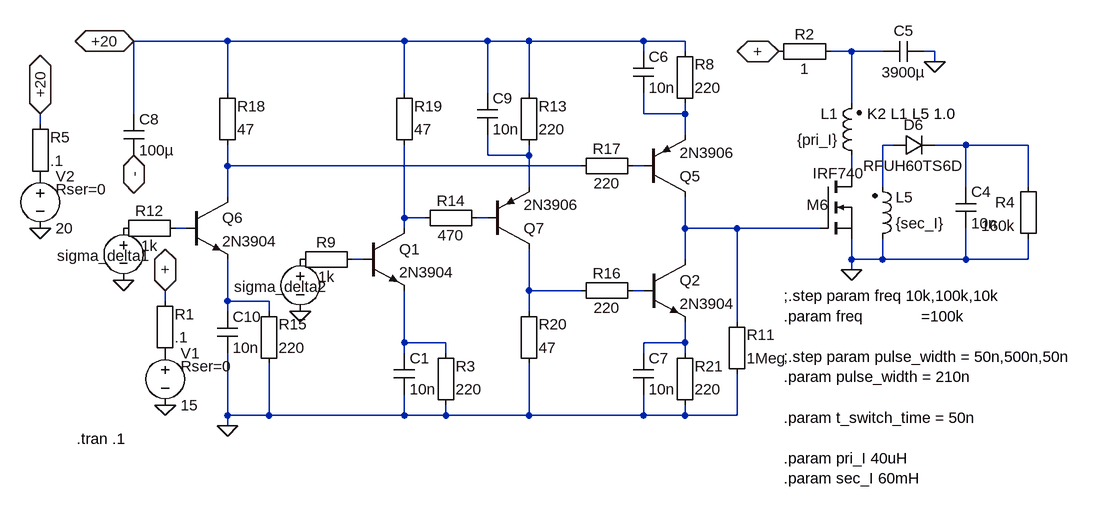
[diagram p0: schematic metal_SMPS_400v_70%_5.asc]
metal_SMPS_400v_70%_5.asc, the LTspice schematic file:
Version 4
SHEET 1 6068 1612
WIRE 2288 -2576 2144 -2576
WIRE 2560 -2576 2288 -2576
WIRE 2688 -2576 2560 -2576
WIRE 2752 -2576 2688 -2576
WIRE 2928 -2576 2752 -2576
WIRE 2992 -2576 2928 -2576
WIRE 2928 -2560 2928 -2576
WIRE 2992 -2560 2992 -2576
WIRE 3248 -2560 3216 -2560
WIRE 3296 -2560 3248 -2560
WIRE 3376 -2560 3360 -2560
WIRE 3376 -2544 3376 -2560
WIRE 2288 -2496 2288 -2576
WIRE 2560 -2496 2560 -2576
WIRE 2688 -2496 2688 -2576
WIRE 2752 -2496 2752 -2576
WIRE 3248 -2480 3248 -2560
WIRE 2144 -2464 2144 -2576
WIRE 2928 -2464 2928 -2496
WIRE 2992 -2464 2992 -2480
WIRE 2992 -2464 2928 -2464
WIRE 2000 -2448 2000 -2464
WIRE 2992 -2432 2992 -2464
WIRE 3312 -2416 3296 -2416
WIRE 3424 -2416 3376 -2416
WIRE 3520 -2416 3424 -2416
WIRE 2688 -2400 2688 -2432
WIRE 2752 -2400 2752 -2416
WIRE 2752 -2400 2688 -2400
WIRE 2288 -2384 2288 -2416
WIRE 2832 -2384 2288 -2384
WIRE 2928 -2384 2912 -2384
WIRE 3248 -2368 3248 -2400
WIRE 2752 -2352 2752 -2400
WIRE 3296 -2352 3296 -2416
WIRE 3424 -2352 3424 -2416
WIRE 3520 -2352 3520 -2416
WIRE 2288 -2336 2288 -2384
WIRE 2560 -2304 2560 -2416
WIRE 2592 -2304 2560 -2304
WIRE 2688 -2304 2672 -2304
WIRE 2224 -2288 2208 -2288
WIRE 2560 -2288 2560 -2304
WIRE 2992 -2288 2992 -2336
WIRE 3072 -2288 2992 -2288
WIRE 3200 -2288 3072 -2288
WIRE 2496 -2240 2480 -2240
WIRE 2992 -2240 2992 -2288
WIRE 3248 -2240 3248 -2272
WIRE 3296 -2240 3296 -2272
WIRE 3296 -2240 3248 -2240
WIRE 3424 -2240 3424 -2288
WIRE 3424 -2240 3296 -2240
WIRE 3520 -2240 3520 -2272
WIRE 3520 -2240 3424 -2240
WIRE 3248 -2224 3248 -2240
WIRE 2752 -2192 2752 -2256
WIRE 2832 -2192 2752 -2192
WIRE 2928 -2192 2912 -2192
WIRE 2192 -2176 2192 -2192
WIRE 2288 -2176 2288 -2240
WIRE 2352 -2176 2288 -2176
WIRE 2288 -2160 2288 -2176
WIRE 2352 -2160 2352 -2176
WIRE 2752 -2160 2752 -2192
WIRE 3072 -2144 3072 -2288
WIRE 2560 -2112 2560 -2192
WIRE 2624 -2112 2560 -2112
WIRE 2992 -2112 2992 -2144
WIRE 2992 -2112 2928 -2112
WIRE 2560 -2096 2560 -2112
WIRE 2624 -2096 2624 -2112
WIRE 2928 -2096 2928 -2112
WIRE 2992 -2096 2992 -2112
WIRE 2288 -2000 2288 -2096
WIRE 2352 -2000 2352 -2080
WIRE 2352 -2000 2288 -2000
WIRE 2560 -2000 2560 -2032
WIRE 2560 -2000 2352 -2000
WIRE 2624 -2000 2624 -2016
WIRE 2624 -2000 2560 -2000
WIRE 2752 -2000 2752 -2080
WIRE 2752 -2000 2624 -2000
WIRE 2928 -2000 2928 -2032
WIRE 2928 -2000 2752 -2000
WIRE 2992 -2000 2992 -2016
WIRE 2992 -2000 2928 -2000
WIRE 3072 -2000 3072 -2064
WIRE 3072 -2000 2992 -2000
WIRE 2288 -1984 2288 -2000
FLAG 3248 -2224 0
FLAG 3376 -2544 0
FLAG 3136 -2560 +
IOPIN 3136 -2560 BiDir
FLAG 2144 -2400 -
IOPIN 2144 -2400 BiDir
FLAG 2400 -2160 0
FLAG 2128 -2208 0
FLAG 2144 -2576 +20
IOPIN 2144 -2576 BiDir
FLAG 2288 -1984 0
FLAG 2192 -2192 +
IOPIN 2192 -2192 BiDir
FLAG 2192 -2016 0
FLAG 2000 -2464 +20
IOPIN 2000 -2464 BiDir
FLAG 2000 -2288 0
SYMBOL ind2 3280 -2256 M180
WINDOW 0 36 80 Left 2
WINDOW 3 36 40 Left 2
SYMATTR InstName L5
SYMATTR Value {sec_I}
SYMATTR SpiceLine Rser=.42
SYMATTR Type ind
SYMBOL diode 3312 -2400 R270
WINDOW 0 32 32 VTop 2
WINDOW 3 0 32 VBottom 2
SYMATTR InstName D6
SYMATTR Value RFUH60TS6D
SYMBOL Misc\\EuropeanCap 3408 -2352 R0
SYMATTR InstName C4
SYMATTR Value 10n
SYMBOL Misc\\EuropeanResistor 3536 -2368 M0
SYMATTR InstName R4
SYMATTR Value 160k
SYMBOL nmos 3200 -2368 R0
WINDOW 0 -21 44 Left 2
WINDOW 3 -12 -5 Left 2
SYMATTR InstName M6
SYMATTR Value IRF740
SYMBOL ind2 3264 -2384 R180
WINDOW 0 36 80 Left 2
WINDOW 3 36 40 Left 2
SYMATTR InstName L1
SYMATTR Value {pri_I}
SYMATTR SpiceLine Rser=.0003
SYMATTR Type ind
SYMBOL Misc\\EuropeanCap 3360 -2576 R90
WINDOW 0 0 32 VBottom 2
WINDOW 3 32 32 VTop 2
SYMATTR InstName C5
SYMATTR Value 3900µ
SYMATTR SpiceLine Rser=.005
SYMBOL Misc\\EuropeanResistor 3120 -2576 M90
WINDOW 0 5 56 VBottom 2
WINDOW 3 27 56 VTop 2
SYMATTR InstName R2
SYMATTR Value 1
SYMBOL Misc\\EuropeanCap 2912 -2560 R0
SYMATTR InstName C6
SYMATTR Value 10n
SYMATTR SpiceLine V=400 Irms=1 Rser=.32 Lser=0
SYMBOL Misc\\EuropeanResistor 2976 -2464 M180
WINDOW 0 31 76 Left 2
WINDOW 3 31 40 Left 2
SYMATTR InstName R8
SYMATTR Value 220
SYMBOL Misc\\EuropeanCap 2128 -2464 R0
SYMATTR InstName C8
SYMATTR Value 100µ
SYMATTR SpiceLine V=400 Irms=1 Rser=.32 Lser=0
SYMBOL npn3 2496 -2288 R0
SYMATTR InstName Q1
SYMATTR Value 2N3904
SYMBOL Misc\\EuropeanResistor 2384 -2256 M90
WINDOW 0 5 56 VBottom 2
WINDOW 3 27 56 VTop 2
SYMATTR InstName R9
SYMATTR Value 1k
SYMBOL npn3 2928 -2240 R0
SYMATTR InstName Q2
SYMATTR Value 2N3904
SYMBOL pnp2 2928 -2336 M180
SYMATTR InstName Q5
SYMATTR Value 2N3906
SYMBOL Misc\\EuropeanResistor 3056 -2048 M180
WINDOW 0 31 76 Left 2
WINDOW 3 31 40 Left 2
SYMATTR InstName R11
SYMATTR Value 1Meg
SYMBOL npn3 2224 -2336 R0
SYMATTR InstName Q6
SYMATTR Value 2N3904
SYMBOL Misc\\EuropeanResistor 2112 -2304 M90
WINDOW 0 5 56 VBottom 2
WINDOW 3 27 56 VTop 2
SYMATTR InstName R12
SYMATTR Value 1k
SYMBOL pnp2 2688 -2256 M180
SYMATTR InstName Q7
SYMATTR Value 2N3906
SYMBOL Misc\\EuropeanResistor 2736 -2400 M180
WINDOW 0 31 76 Left 2
WINDOW 3 31 40 Left 2
SYMATTR InstName R13
SYMATTR Value 220
SYMBOL Misc\\EuropeanResistor 2576 -2320 M90
WINDOW 0 5 56 VBottom 2
WINDOW 3 27 56 VTop 2
SYMATTR InstName R14
SYMATTR Value 470
SYMBOL Misc\\EuropeanCap 2672 -2496 R0
SYMATTR InstName C9
SYMATTR Value 10n
SYMATTR SpiceLine V=400 Irms=1 Rser=.32 Lser=0
SYMBOL Misc\\EuropeanResistor 2336 -2064 M180
WINDOW 0 31 76 Left 2
WINDOW 3 31 40 Left 2
SYMATTR InstName R15
SYMATTR Value 220
SYMBOL Misc\\EuropeanCap 2272 -2160 R0
SYMATTR InstName C10
SYMATTR Value 10n
SYMATTR SpiceLine V=400 Irms=1 Rser=.32 Lser=0
SYMBOL Misc\\EuropeanResistor 2928 -2176 M270
WINDOW 0 27 56 VTop 2
WINDOW 3 5 56 VBottom 2
SYMATTR InstName R16
SYMATTR Value 220
SYMBOL Misc\\EuropeanResistor 2816 -2400 M90
WINDOW 0 5 56 VBottom 2
WINDOW 3 27 56 VTop 2
SYMATTR InstName R17
SYMATTR Value 220
SYMBOL Misc\\EuropeanResistor 2272 -2400 M180
WINDOW 0 31 76 Left 2
WINDOW 3 31 40 Left 2
SYMATTR InstName R18
SYMATTR Value 47
SYMBOL Misc\\EuropeanResistor 2544 -2400 M180
WINDOW 0 31 76 Left 2
WINDOW 3 31 40 Left 2
SYMATTR InstName R19
SYMATTR Value 47
SYMBOL Misc\\EuropeanResistor 2736 -2064 M180
WINDOW 0 31 76 Left 2
WINDOW 3 31 40 Left 2
SYMATTR InstName R20
SYMATTR Value 47
SYMBOL Misc\\EuropeanCap 2912 -2096 R0
SYMATTR InstName C7
SYMATTR Value 10n
SYMATTR SpiceLine V=400 Irms=1 Rser=.32 Lser=0
SYMBOL Misc\\EuropeanResistor 2976 -2000 M180
WINDOW 0 31 76 Left 2
WINDOW 3 31 40 Left 2
SYMATTR InstName R21
SYMATTR Value 220
SYMBOL voltage 2128 -2304 M0
WINDOW 0 -42 58 Left 2
WINDOW 3 -134 119 Invisible 2
WINDOW 123 0 0 Left 2
SYMATTR InstName sigma_delta1
SYMATTR Value PULSE(0 5 0 10n 10n {t_switch_time} {1/freq})
SYMATTR SpiceLine Rser=0
SYMBOL voltage 2400 -2256 M0
WINDOW 0 -42 58 Left 2
WINDOW 3 -134 119 Invisible 2
WINDOW 123 0 0 Left 2
SYMATTR InstName sigma_delta2
SYMATTR Value PULSE(0 5 {pulse_width} 10n 10n {t_switch_time} {1/freq})
SYMATTR SpiceLine Rser=0
SYMBOL voltage 2192 -2112 R0
WINDOW 123 0 0 Left 2
WINDOW 39 24 36 Left 2
SYMATTR SpiceLine Rser=0
SYMATTR InstName V1
SYMATTR Value 15
SYMBOL Misc\\EuropeanResistor 2176 -2080 M180
WINDOW 0 31 76 Left 2
WINDOW 3 31 40 Left 2
SYMATTR InstName R1
SYMATTR Value .1
SYMBOL Misc\\EuropeanResistor 2608 -2000 M180
WINDOW 0 31 76 Left 2
WINDOW 3 31 40 Left 2
SYMATTR InstName R3
SYMATTR Value 220
SYMBOL Misc\\EuropeanCap 2544 -2096 R0
SYMATTR InstName C1
SYMATTR Value 10n
SYMATTR SpiceLine V=400 Irms=1 Rser=.32 Lser=0
SYMBOL voltage 2000 -2384 R0
WINDOW 123 0 0 Left 2
WINDOW 39 24 36 Left 2
SYMATTR SpiceLine Rser=0
SYMATTR InstName V2
SYMATTR Value 20
SYMBOL Misc\\EuropeanResistor 1984 -2352 M180
WINDOW 0 31 76 Left 2
WINDOW 3 31 40 Left 2
SYMATTR InstName R5
SYMATTR Value .1
TEXT 3144 -2184 Left 2 !;.step param freq 10k,100k,10k\n.param freq             =100k\n \n;.step param pulse_width = 50n,500n,50n\n.param pulse_width = 210n\n \n.param t_switch_time = 50n\n \n.param pri_I 40uH\n.param sec_I 60mH
TEXT 3272 -2464 Left 2 !K2 L1 L5 1.0
TEXT 2056 -1964 Left 2 !.tran .1

The netlist it stands for:
* metal_SMPS_400v_70%_5.asc
L5 0 N003 {sec_I} Rser=.42
D6 N003 N004 RFUH60TS6D
C4 N004 0 10n
R4 N004 0 160k
M6 N008 N012 0 0 IRF740
L1 N008 N001 {pri_I} Rser=.0003
C5 0 N001 3900µ Rser=.005
R2 + N001 1
C6 +20 N002 10n V=400 Irms=1 Rser=.32 Lser=0
R8 N002 +20 220
C8 +20 - 100µ V=400 Irms=1 Rser=.32 Lser=0
Q1 N009 N013 N017 0 2N3904
R9 P001 N013 1k
Q2 N012 N015 N018 0 2N3904
Q5 N012 N007 N002 0 2N3906
R11 0 N012 1Meg
Q6 N006 N011 N016 0 2N3904
R12 P002 N011 1k
Q7 N014 N010 N005 0 2N3906
R13 N005 +20 220
R14 N009 N010 470
C9 +20 N005 10n V=400 Irms=1 Rser=.32 Lser=0
R15 0 N016 220
C10 N016 0 10n V=400 Irms=1 Rser=.32 Lser=0
R16 N015 N014 220
R17 N006 N007 220
R18 N006 +20 47
R19 N009 +20 47
R20 0 N014 47
C7 N018 0 10n V=400 Irms=1 Rser=.32 Lser=0
R21 0 N018 220
V§sigma_delta1 P002 0 PULSE(0 5 0 10n 10n {t_switch_time} {1/freq}) Rser=0
V§sigma_delta2 P001 0 PULSE(0 5 {pulse_width} 10n 10n {t_switch_time} {1/freq}) Rser=0
V1 P003 0 15 Rser=0
R1 P003 + .1
R3 0 N017 220
C1 N017 0 10n V=400 Irms=1 Rser=.32 Lser=0
V2 P004 0 20 Rser=0
R5 P004 +20 .1
.model D D
.lib standard.dio
.model NPN NPN
.model PNP PNP
.lib standard.bjt
.model NMOS NMOS
.model PMOS PMOS
.lib standard.mos
;.step param freq 10k,100k,10k
.param freq             =100k
;.step param pulse_width = 50n,500n,50n
.param pulse_width = 210n
.param t_switch_time = 50n
.param pri_I 40uH
.param sec_I 60mH
K2 L1 L5 1.0
.tran .1
.backanno
.end